# EAGLE design TSOC_RS485_EM (EAGLE 6.6.0)
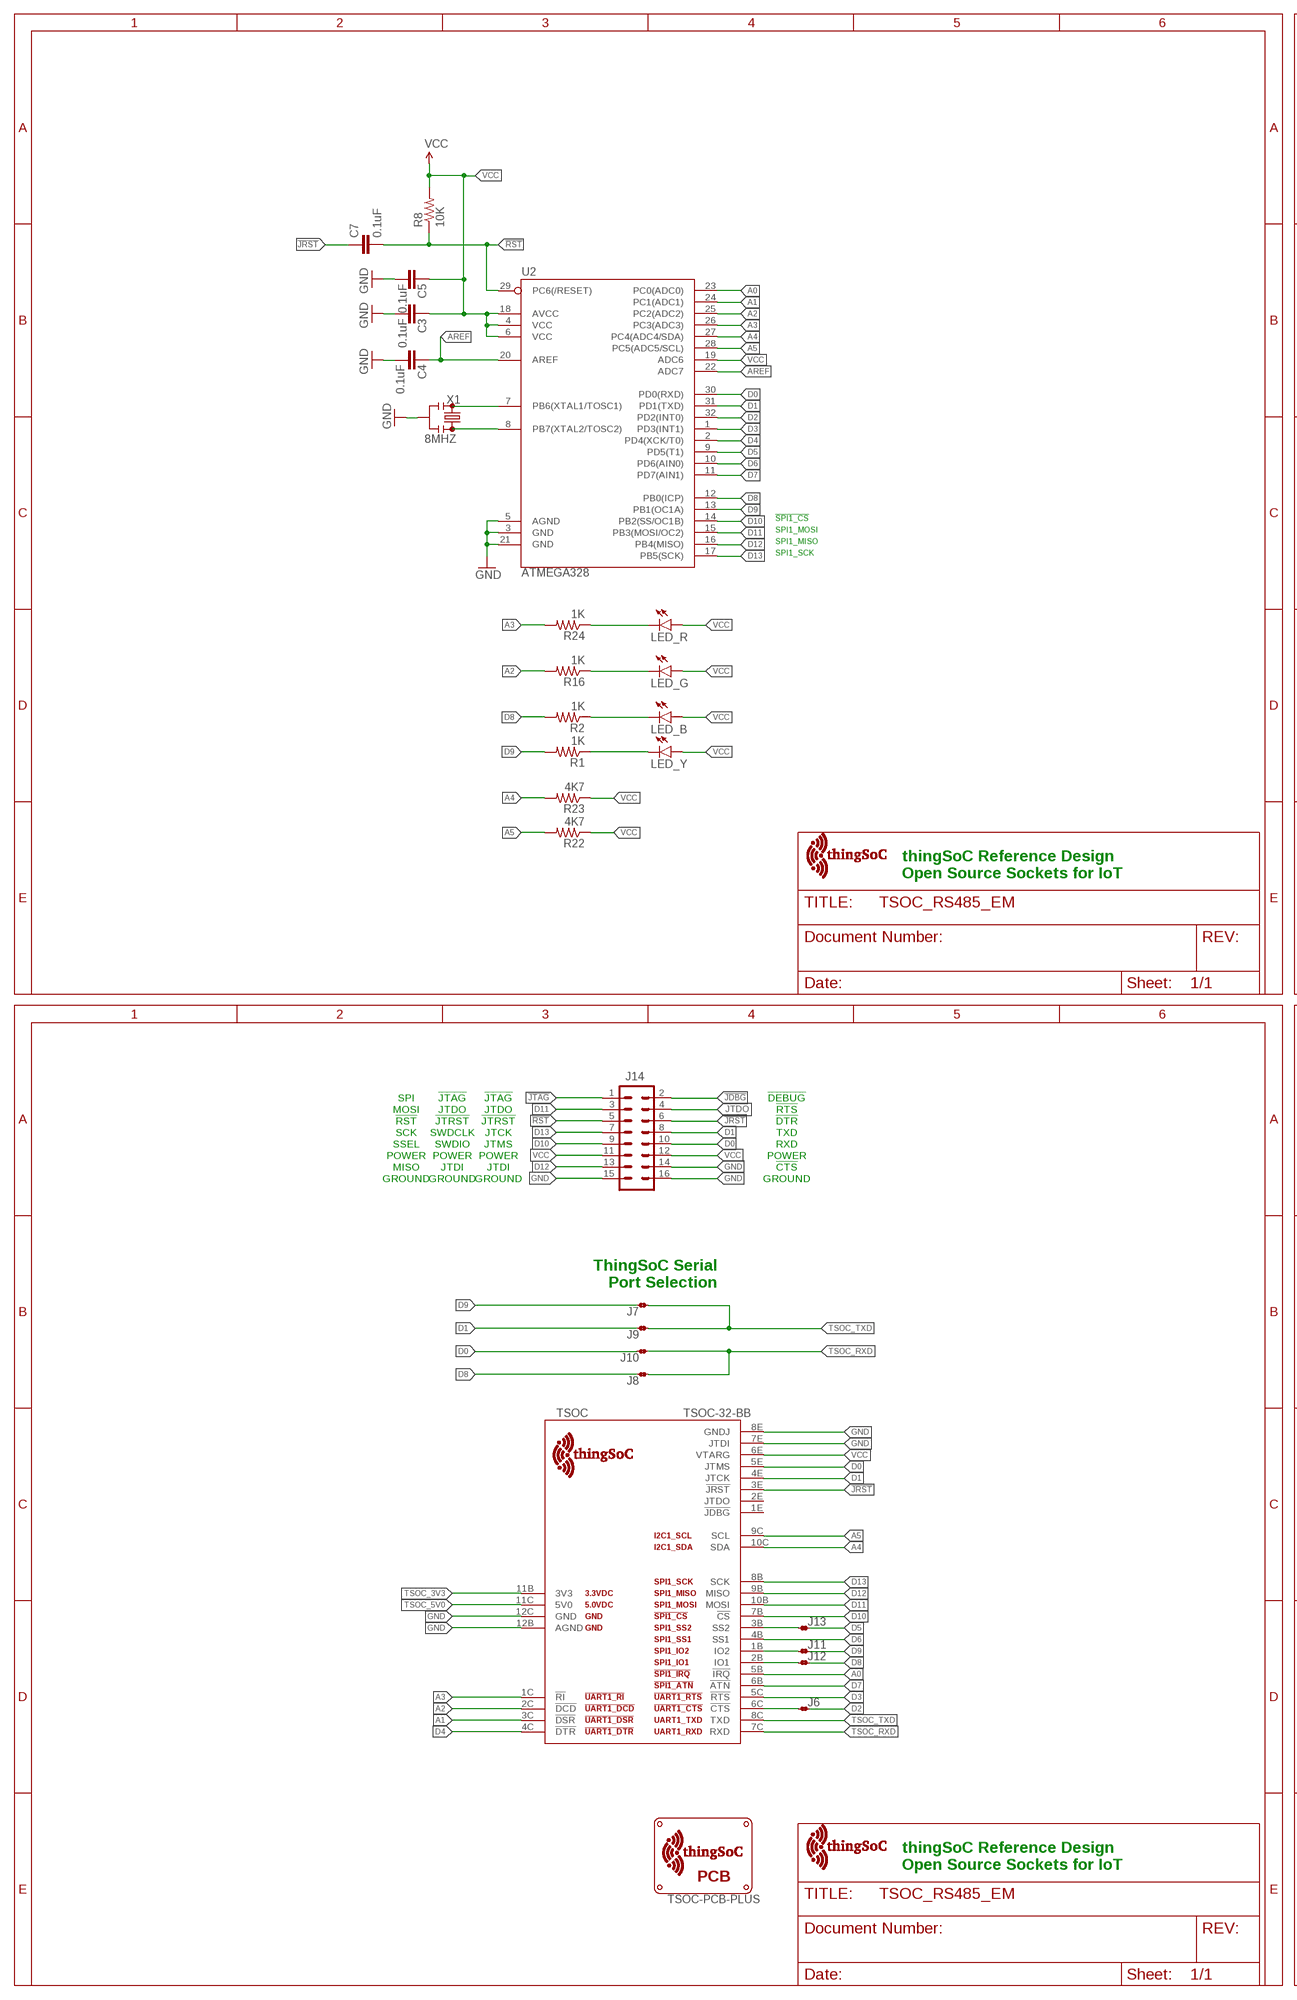
[diagram p0: schematic, sheet 1, part 1 of 2]
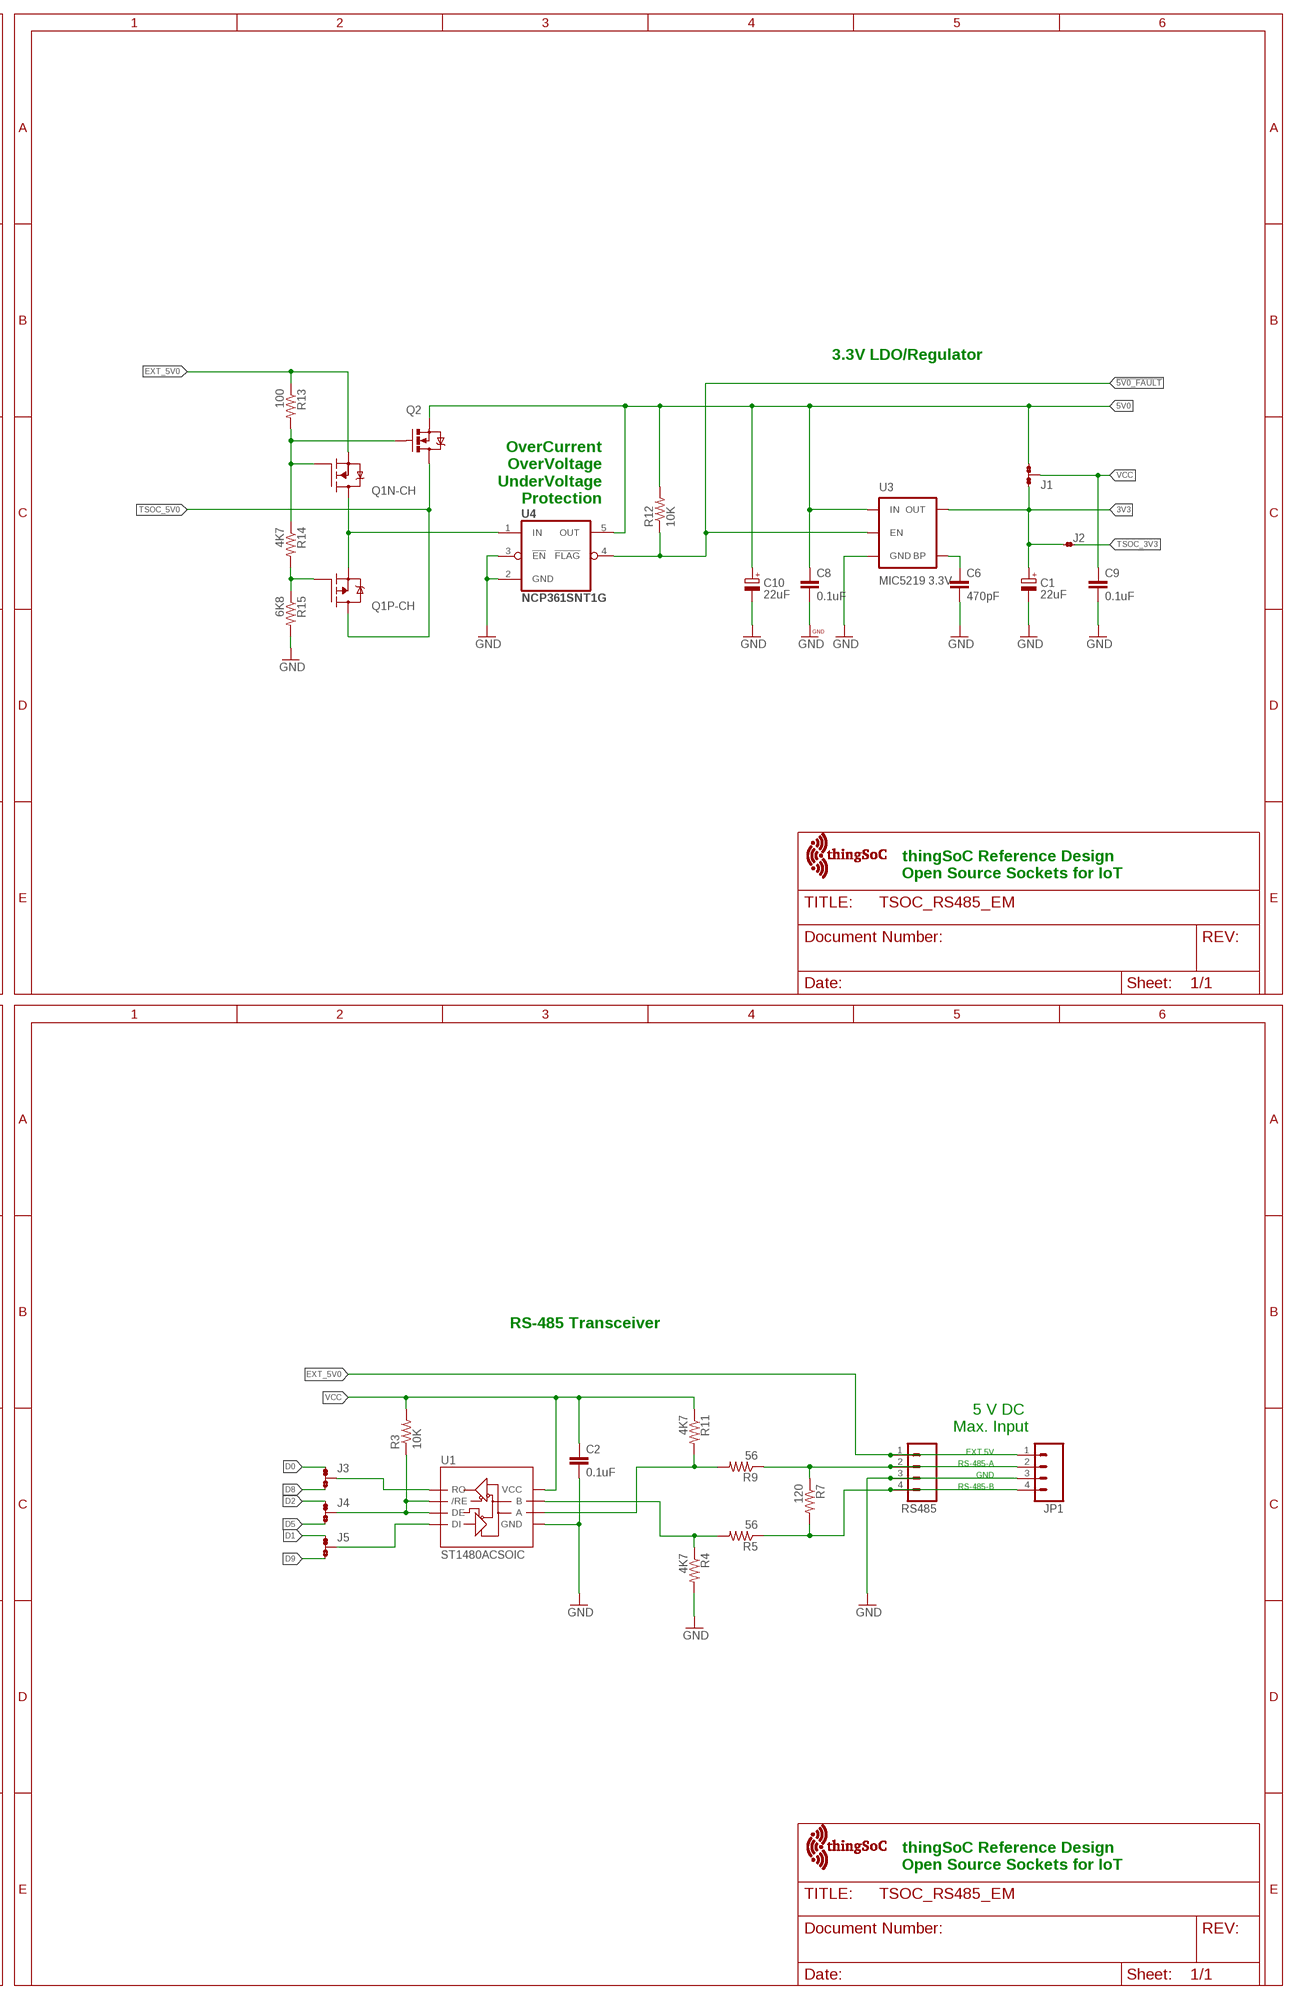
[diagram p1: schematic, sheet 1, part 2 of 2]

## Parts
C1  22uF  CPOL-EUSMCB  [SMC_B]
C2  0.1uF  CAPTYP  [EIA-0402]
C3  0.1uF  CAPTYP  [EIA-0402]
C4  0.1uF  CAPTYP  [EIA-0402]
C5  0.1uF  CAPTYP  [EIA-0402]
C6  470pF  CAPTYP  [EIA-0402]
C7  0.1uF  CAPTYP  [EIA-0402]
C8  0.1uF  CAPTYP  [EIA-0402]
C9  0.1uF  CAPTYP  [EIA-0402]
C10  22uF  CPOL-EUSMCB  [SMC_B]
J1  JMP-3-1_2  [JMP-3-1_2]
J2  JMP-2-NC  [JMP-2-NC]
J3  JMP-3-1_2  [JMP-3-1_2]
J4  JMP-3-1_2  [JMP-3-1_2]
J5  JMP-3-1_2  [JMP-3-1_2]
J6  JMP-2-NO  [JMP-2-NO]
J7  JMP-2-NO  [JMP-2-NO]
J8  JMP-2-NO  [JMP-2-NO]
J9  JMP-2-NO  [JMP-2-NO]
J10  JMP-2-NO  [JMP-2-NO]
J11  JMP-2-NC  [JMP-2-NC]
J12  JMP-2-NC  [JMP-2-NC]
J13  JMP-2-NC  [JMP-2-NC]
J14  M08X2  [2X8]
JP1  M04PTH  [1X04]
LED_B  LED0603  [LED-0603]
LED_G  LED0603  [LED-0603]
LED_R  LED0603  [LED-0603]
LED_Y  LED0603  [LED-0603]
Q1  FDC6420C  [SOT95P280X110-6N]
Q2  MOSFET-NCHANNELAO3404A  [SOT23-3]
R1  1K  RESISTOR0402-MIN  [EIA-0402-MIN]
R2  1K  RESISTOR0402-MIN  [EIA-0402-MIN]
R3  10K  RESISTOR0402-MIN  [EIA-0402-MIN]
R4  4K7  RESISTOR0402-MIN  [EIA-0402-MIN]
R5  56  RESISTOR0402-MIN  [EIA-0402-MIN]
R7  120  RESISTOR0402-MIN  [EIA-0402-MIN]
R8  10K  RESISTOR0402-MIN  [EIA-0402-MIN]
R9  56  RESISTOR0402-MIN  [EIA-0402-MIN]
R11  4K7  RESISTOR0402-MIN  [EIA-0402-MIN]
R12  10K  RESISTOR0402-MIN  [EIA-0402-MIN]
R13  100  RESISTOR0402-MIN  [EIA-0402-MIN]
R14  4K7  RESISTOR0402-MIN  [EIA-0402-MIN]
R15  6K8  RESISTOR0402-MIN  [EIA-0402-MIN]
R16  1K  RESISTOR0402-MIN  [EIA-0402-MIN]
R22  4K7  RESISTOR0402-MIN  [EIA-0402-MIN]
R23  4K7  RESISTOR0402-MIN  [EIA-0402-MIN]
R24  1K  RESISTOR0402-MIN  [EIA-0402-MIN]
RS485  M04SCREW  [SCREWTERMINAL-3.5MM-4]
TSOC  TSOC-32-BB  [TSOC-BB-S32]
U1  ST1480ACSOIC  [SO08]
U2  ATMEGA328  ATMEGA168  [TQFP32-08]
U3  MIC5219 3.3V  V_REG_MIC52193.3V  [SOT23-5]
U4  NCP361SNT1G  [SOP95P275X110-5N]
U$3  TSOC-PCB-PLUS  [TSOC-BB-BRD-PLUS]
U$5  TSOC-LOGO-SMALL  [TSOC-LOGO-SML]
U$6  TSOC-LOGO-SMALL  [TSOC-LOGO-SML]
U$7  TSOC-LOGO-SMALL  [TSOC-LOGO-SML]
U$8  TSOC-LOGO-SMALL  [TSOC-LOGO-SML]
X1  8MHZ  RESONATOR8MHZ  [RESONATOR-SMD]

## Nets
3V3: C1.+ J1.1 J2.1 U3.5(OUT)
5V0: C8.1 C10.+ J1.3 Q2.2(S) R12.2 U3.1(IN) U4.5(OUT)
!5V0_FAULT: R12.1 U3.3(EN) U4.4(!FLAG)
!JDBG: J14.2
!JRST: C7.1 J14.6 TSOC.3E(!JRST)
!JTAG: J14.1
!RST: C7.2 J14.5 R8.1 U2.29(PC6(/RESET))
A: R9.2 R11.2 U1.6(A)
A0: TSOC.5B(!IRQ) U2.23(PC0(ADC0))
A1: TSOC.3C(!DSR) U2.24(PC1(ADC1))
A2: R16.2 TSOC.2C(!DCD) U2.25(PC2(ADC2))
A3: R24.2 TSOC.1C(!RI) U2.26(PC3(ADC3))
A4: R23.2 TSOC.10C(SDA) U2.27(PC4(ADC4/SDA))
A5: R22.2 TSOC.9C(SCL) U2.28(PC5(ADC5/SCL))
AO: JP1.2 R7.1 R9.1 RS485.2
AREF: C4.2 U2.20(AREF) U2.22(ADC7)
B: R4.1 R5.2 U1.7(B)
BO: JP1.4 R5.1 R7.2 RS485.4
BYPASS1: C6.1 U3.4(BP)
D0: J3.1 J10.2 J14.10 TSOC.5E(JTMS) U2.30(PD0(RXD))
D1: J5.1 J9.2 J14.8 TSOC.4E(JTCK) U2.31(PD1(TXD))
D2: J4.1 J6.2 U2.32(PD2(INT0))
D3: TSOC.5C(!RTS) U2.1(PD3(INT1))
D4: TSOC.4C(!DTR) U2.2(PD4(XCK/T0))
D5: J4.3 J13.2 U2.9(PD5(T1))
D6: TSOC.4B(SS1) U2.10(PD6(AIN0))
D7: TSOC.6B(!ATN) U2.11(PD7(AIN1))
D8: J3.3 J8.2 J12.2 R2.2 U2.12(PB0(ICP))
D9: J5.3 J7.2 J11.2 R1.2 U2.13(PB1(OC1A))
D10: J14.9 TSOC.7B(!CS) U2.14(PB2(SS/OC1B))
D11: J14.3 TSOC.10B(MOSI) U2.15(PB3(MOSI/OC2))
D12: J14.13 TSOC.9B(MISO) U2.16(PB4(MISO))
D13: J14.7 TSOC.8B(SCK) U2.17(PB5(SCK))
DE: J4.2 R3.1 U1.2(/RE) U1.3(DE)
DI: J5.2 U1.4(DI)
EXT_5V0: JP1.1 Q1.5(N-CH:S) R13.1 RS485.1
GND: C1.- C2.2 C3.1 C4.1 C5.1 C6.2 C8.2 C9.2 C10.- J14.14 J14.15 J14.16 JP1.3 R4.2 R15.2 RS485.3 TSOC.7E(JTDI) TSOC.8E(GNDJ) TSOC.12B(AGND) TSOC.12C(GND) U1.5(GND) U2.3(GND) U2.5(AGND) U2.21(GND) U3.2(GND) U4.2(GND) U4.3(!EN) X1.2
JTDO: J14.4
LEDB: LED_B.C R2.1
LEDG: LED_G.C R16.1
LEDR: LED_R.C R24.1
LEDY: LED_Y.C R1.1
N$1: J13.1 TSOC.3B(SS2)
NGATE: Q1.1(N-CH:G) Q2.1(G) R13.2 R14.1
PGATE: Q1.3(P-CH:G) R14.2 R15.1
RXD: J3.2 U1.1(RO)
TSOC_3V3: J2.2 TSOC.11B(3V3)
TSOC_5V0: Q1.4(P-CH:D) Q2.3(D) TSOC.11C(5V0)
TSOC_CTS: J6.1 TSOC.6C(!CTS)
TSOC_D8: J12.1 TSOC.2B(IO1)
TSOC_D9: J11.1 TSOC.1B(IO2)
TSOC_RXD: J8.1 J10.1 TSOC.7C(RXD)
TSOC_TXD: J7.1 J9.1 TSOC.8C(TXD)
VCC: C2.1 C3.2 C5.2 C9.1 J1.2 J14.11 J14.12 LED_B.A LED_G.A LED_R.A LED_Y.A R3.2 R8.2 R11.1 R22.1 R23.1 TSOC.6E(VTARG) U1.8(VCC) U2.4(VCC) U2.6(VCC) U2.18(AVCC) U2.19(ADC6)
VIN: Q1.2(P-CH:S) Q1.6(N-CH:D) U4.1(IN)
XIN: U2.7(PB6(XTAL1/TOSC1)) X1.3
XOUT: U2.8(PB7(XTAL2/TOSC2)) X1.1
Unconnected: TSOC.1E(!JDBG) TSOC.2E(JTDO)

## Notes on the sheet
- 3.3V LDO/Regulator
- OverCurrent
  OverVoltage
  UnderVoltage
  Protection
- !SPI1_CS
- SPI1_MOSI
- SPI1_MISO
- SPI1_SCK
- thingSoC Reference Design
  Open Source Sockets for IoT
- thingSoC Reference Design
  Open Source Sockets for IoT
- SPI | !JTAG | !JTAG | !DEBUG
- MOSI | JTDO | JTDO | !RTS
- !RST | !JTRST | !JTRST | !DTR
- SCK | SWDCLK | JTCK | TXD
- SSEL | SWDIO | JTMS | RXD
- POWER | POWER | POWER | POWER
- MISO | JTDI | JTDI | !CTS
- GROUND | GROUND | GROUND | GROUND
- ThingSoC Serial
  Port Selection
- RS-485 Transceiver
- 5 V DC 
  Max. Input
- EXT 5V
- RS-485-A
- GND
- RS-485-B
- thingSoC Reference Design
  Open Source Sockets for IoT
- thingSoC Reference Design
  Open Source Sockets for IoT

## Library data of the parts
C1 C10 = rcl:CPOL-EU: POLARIZED CAPACITOR, European symbol
C2-C9 = PatternAgents-ProtoPads:CAP: Capacitor Standard 0603 ceramic capacitor, and 0.1" leaded capacitor.
J1 = PatternAgents-ProtoPads:JMP-3-1_2: Three Terminal Jumper - 1 & 2 Connected Positions 1and 2 are normally connected. PatternAgents ProtoPads Library Schematic and PCB layout libraries for design patterns by PatternAgents. For the CADSoft Eagle CAD program : http://www.cadsoftusa.com/download-eagle/ Source LBR : http://www.patternagents.com Github : https://github.com/PatternAgents License : http://creativecommons.org/licenses/by-sa/4.0/ (Creative Commons 4.0) THIS SOFTWARE IS PROVIDED BY THE CONTRIBUTORS "AS IS" AND WITHOUT ANY EXPRESS OR IMPLIED WARRANTIES, INCLUDING, BUT NOT LIMITED TO, THE IMPLIED WARRANTIES OF MERCHANTABILITY AND FITNESS FOR A PARTICULAR PURPOSE ARE DISCLAIMED. IN NO EVENT SHALL THE COPYRIGHT OWNER OR CONTRIBUTORS BE LIABLE FOR ANY DIRECT, INDIRECT, INCIDENTAL, SPECIAL, EXEMPLARY, OR CONSEQUENTIAL DAMAGES (INCLUDING, BUT NOT LIMITED TO, PROCUREMENT OF SUBSTITUTE GOODS OR SERVICES; LOSS OF USE, DATA, OR PROFITS; OR BUSINESS INTERRUPTION) HOWEVER CAUSED AND ON ANY THEORY OF LIABILITY, WHETHER IN CONTRACT, STRICT LIABILITY, OR TORT (INCLUDING NEGLIGENCE OR OTHERWISE) ARISING IN ANY WAY OUT OF THE USE OF THIS SOFTWARE, EVEN IF ADVISED OF THE POSSIBILITY OF SUCH DAMAGE.; BOM: EXCLUDE
J2 J11-J13 = TSOC-MODBUS-ESM:JMP-2-NC: Two Terminal Jumper - Normally Closed Positions 1 and 2 are normally connected. PatternAgents ProtoPads Library Schematic and PCB layout libraries for design patterns by PatternAgents. For the CADSoft Eagle CAD program : http://www.cadsoftusa.com/download-eagle/ Source LBR : http://www.patternagents.com Github : https://github.com/PatternAgents License : http://creativecommons.org/licenses/by-sa/4.0/ (Creative Commons 4.0) THIS SOFTWARE IS PROVIDED BY THE CONTRIBUTORS "AS IS" AND WITHOUT ANY EXPRESS OR IMPLIED WARRANTIES, INCLUDING, BUT NOT LIMITED TO, THE IMPLIED WARRANTIES OF MERCHANTABILITY AND FITNESS FOR A PARTICULAR PURPOSE ARE DISCLAIMED. IN NO EVENT SHALL THE COPYRIGHT OWNER OR CONTRIBUTORS BE LIABLE FOR ANY DIRECT, INDIRECT, INCIDENTAL, SPECIAL, EXEMPLARY, OR CONSEQUENTIAL DAMAGES (INCLUDING, BUT NOT LIMITED TO, PROCUREMENT OF SUBSTITUTE GOODS OR SERVICES; LOSS OF USE, DATA, OR PROFITS; OR BUSINESS INTERRUPTION) HOWEVER CAUSED AND ON ANY THEORY OF LIABILITY, WHETHER IN CONTRACT, STRICT LIABILITY, OR TORT (INCLUDING NEGLIGENCE OR OTHERWISE) ARISING IN ANY WAY OUT OF THE USE OF THIS SOFTWARE, EVEN IF ADVISED OF THE POSSIBILITY OF SUCH DAMAGE.; BOM: EXCLUDE
J3-J5 = TSOC_RS485_EM:JMP-3-1_2: Three Terminal Jumper - 1 & 2 Connected Positions 1and 2 are normally connected. PatternAgents ProtoPads Library Schematic and PCB layout libraries for design patterns by PatternAgents. For the CADSoft Eagle CAD program : http://www.cadsoftusa.com/download-eagle/ Source LBR : http://www.patternagents.com Github : https://github.com/PatternAgents License : http://creativecommons.org/licenses/by-sa/4.0/ (Creative Commons 4.0) THIS SOFTWARE IS PROVIDED BY THE CONTRIBUTORS "AS IS" AND WITHOUT ANY EXPRESS OR IMPLIED WARRANTIES, INCLUDING, BUT NOT LIMITED TO, THE IMPLIED WARRANTIES OF MERCHANTABILITY AND FITNESS FOR A PARTICULAR PURPOSE ARE DISCLAIMED. IN NO EVENT SHALL THE COPYRIGHT OWNER OR CONTRIBUTORS BE LIABLE FOR ANY DIRECT, INDIRECT, INCIDENTAL, SPECIAL, EXEMPLARY, OR CONSEQUENTIAL DAMAGES (INCLUDING, BUT NOT LIMITED TO, PROCUREMENT OF SUBSTITUTE GOODS OR SERVICES; LOSS OF USE, DATA, OR PROFITS; OR BUSINESS INTERRUPTION) HOWEVER CAUSED AND ON ANY THEORY OF LIABILITY, WHETHER IN CONTRACT, STRICT LIABILITY, OR TORT (INCLUDING NEGLIGENCE OR OTHERWISE) ARISING IN ANY WAY OUT OF THE USE OF THIS SOFTWARE, EVEN IF ADVISED OF THE POSSIBILITY OF SUCH DAMAGE.; BOM: EXCLUDE
J6-J10 = TSOC_RS485_EM:JMP-2-NO: Two Terminal Jumper - Normally Open Positions 1 and 2 are normally NOT connected. PatternAgents ProtoPads Library Schematic and PCB layout libraries for design patterns by PatternAgents. For the CADSoft Eagle CAD program : http://www.cadsoftusa.com/download-eagle/ Source LBR : http://www.patternagents.com Github : https://github.com/PatternAgents License : http://creativecommons.org/licenses/by-sa/4.0/ (Creative Commons 4.0) THIS SOFTWARE IS PROVIDED BY THE CONTRIBUTORS "AS IS" AND WITHOUT ANY EXPRESS OR IMPLIED WARRANTIES, INCLUDING, BUT NOT LIMITED TO, THE IMPLIED WARRANTIES OF MERCHANTABILITY AND FITNESS FOR A PARTICULAR PURPOSE ARE DISCLAIMED. IN NO EVENT SHALL THE COPYRIGHT OWNER OR CONTRIBUTORS BE LIABLE FOR ANY DIRECT, INDIRECT, INCIDENTAL, SPECIAL, EXEMPLARY, OR CONSEQUENTIAL DAMAGES (INCLUDING, BUT NOT LIMITED TO, PROCUREMENT OF SUBSTITUTE GOODS OR SERVICES; LOSS OF USE, DATA, OR PROFITS; OR BUSINESS INTERRUPTION) HOWEVER CAUSED AND ON ANY THEORY OF LIABILITY, WHETHER IN CONTRACT, STRICT LIABILITY, OR TORT (INCLUDING NEGLIGENCE OR OTHERWISE) ARISING IN ANY WAY OUT OF THE USE OF THIS SOFTWARE, EVEN IF ADVISED OF THE POSSIBILITY OF SUCH DAMAGE.; BOM: EXCLUDE
J14 = PatternAgents-ProtoPads:M08X2: .1" headers, two rows of 8 each
JP1 = TSOC_RS485_EM:M04: Header 4 Standard 4-pin 0.1" header. Use with straight break away headers (SKU : PRT-00116), right angle break away headers (PRT-00553), swiss pins (PRT-00743), machine pins (PRT-00117), and female headers (PRT-00115). Molex polarized connector foot print use with SKU : PRT-08231 with associated crimp pins and housings. 1MM SMD Version SKU: PRT-10208
LED_B LED_G LED_R LED_Y = TSOC-MODBUS-ESM:LED: LEDs Standard schematic elements and footprints for 5mm, 3mm, 1206, and 0603 sized LEDs. 5mm - Spark Fun Electronics SKU : COM-00529 (and others)
Q1 = TSOC-ESP8266-BASE:FDC6420C: N and P Channel Power Trench MOSFETs
Q2 = SparkFun-DiscreteSemi:MOSFET-NCHANNEL: Common NMOSFET Parts MFG P/N Store ID Prod ID FDD8780 TRANS-09984 SI7820DN TRANS-11055 FDS6630A IC-08089 2N7002PW TRANS-11151 FQP30N06L COM-10213 TRANS-10060 BSS123LT1G TRANS-08345 BSS138 TRANS-00830 BS170 2N7000; PROD_ID: TRAN-12988
R1-R5 R7-R9 R11-R16 R22-R24 = PatternAgents-ProtoPads:RESISTOR: Resistor Basic schematic elements and footprints for 0603, 1206, and PTH resistors.
RS485 = TSOC_RS485_EM:M04: Header 4 Standard 4-pin 0.1" header. Use with straight break away headers (SKU : PRT-00116), right angle break away headers (PRT-00553), swiss pins (PRT-00743), machine pins (PRT-00117), and female headers (PRT-00115). Molex polarized connector foot print use with SKU : PRT-08231 with associated crimp pins and housings. 1MM SMD Version SKU: PRT-10208; PROD_ID: Combine 2x8399
TSOC = thingSoC:TSOC-32: thingSoC Thirty-Two (32) Pin Socket Source LBR : http://www.thingsoc.com Github : https://github.com/thingsoc License : http://creativecommons.org/licenses/by-sa/4.0/ (Creative Commons 4.0) THIS SOFTWARE IS PROVIDED BY THE CONTRIBUTORS "AS IS" AND WITHOUT ANY EXPRESS OR IMPLIED WARRANTIES, INCLUDING, BUT NOT LIMITED TO, THE IMPLIED WARRANTIES OF MERCHANTABILITY AND FITNESS FOR A PARTICULAR PURPOSE ARE DISCLAIMED. IN NO EVENT SHALL THE COPYRIGHT OWNER OR CONTRIBUTORS BE LIABLE FOR ANY DIRECT, INDIRECT, INCIDENTAL, SPECIAL, EXEMPLARY, OR CONSEQUENTIAL DAMAGES (INCLUDING, BUT NOT LIMITED TO, PROCUREMENT OF SUBSTITUTE GOODS OR SERVICES; LOSS OF USE, DATA, OR PROFITS; OR BUSINESS INTERRUPTION) HOWEVER CAUSED AND ON ANY THEORY OF LIABILITY, WHETHER IN CONTRACT, STRICT LIABILITY, OR TORT (INCLUDING NEGLIGENCE OR OTHERWISE) ARISING IN ANY WAY OUT OF THE USE OF THIS SOFTWARE, EVEN IF ADVISED OF THE POSSIBILITY OF SUCH DAMAGE.
U1 = TSOC-MODBUS-ESM:ST1480AC: ST Microelectronics ST1480AC RS-485/RS-422 Transceiver Source : http://www.st.com/web/en/resource/technical/document/datasheet/CD00003136.pdf The ST1480Ax is ±15 kV ESD protected, 3.3 V low power transceiver for RS-485 and RS-422 communications. The device contains one driver and one receiver in half duplex configuration. The ST1480Ax transmits and receives at a guaranteed data rate of at least 12 Mbps. All transmitter outputs and receiver inputs are protected to ±15 kV using Human Body Model. Driver is short-circuit current limited and is protected against excessive power dissipation by thermal shutdown circuitry that places the driver outputs into a high-impedance state. The ST1480Ax input has a true fail-safe feature that guarantees a logic high output if both inputs are open circuit, shorted together or in the presence of a termination with no signal on the bus.
U2 = SparkFun:ATMEGA168
U3 = TSOC-ESP8266-BASE:V_REG_MIC5219: V_REG MIC5219 Standard 3.3V and 5V 500mA LDO voltage regulator in SOT-23 layout. Micrel part MIC5219. BP (by-pass) pin is used to lower output noise with 470pF cap, may be left open.; PROD_ID: VREG-09872
U4 = TSOC-ESP8266-BASE:NCP361SNT1G: USB Positive Overvoltage Protection Controller; MPN: NCP361SNT1G; OC_FARNELL: 1642242; OC_NEWARK: 01P0135; PACKAGE: TSOP-5; SUPPLIER: ON Semiconductor
U$3 = thingSoC:TSOC-PCB: thingSoC PCB Outlines Boards Outlines for Standard Sizes (in the DImension Layer) (Registration marks in the tDocu layer - make sure to turn on tDocu/bDocu) Source LBR : http://www.thingsoc.com Github : https://github.com/thingsoc License : http://creativecommons.org/licenses/by-sa/4.0/ (Creative Commons 4.0) THIS SOFTWARE IS PROVIDED BY THE CONTRIBUTORS "AS IS" AND WITHOUT ANY EXPRESS OR IMPLIED WARRANTIES, INCLUDING, BUT NOT LIMITED TO, THE IMPLIED WARRANTIES OF MERCHANTABILITY AND FITNESS FOR A PARTICULAR PURPOSE ARE DISCLAIMED. IN NO EVENT SHALL THE COPYRIGHT OWNER OR CONTRIBUTORS BE LIABLE FOR ANY DIRECT, INDIRECT, INCIDENTAL, SPECIAL, EXEMPLARY, OR CONSEQUENTIAL DAMAGES (INCLUDING, BUT NOT LIMITED TO, PROCUREMENT OF SUBSTITUTE GOODS OR SERVICES; LOSS OF USE, DATA, OR PROFITS; OR BUSINESS INTERRUPTION) HOWEVER CAUSED AND ON ANY THEORY OF LIABILITY, WHETHER IN CONTRACT, STRICT LIABILITY, OR TORT (INCLUDING NEGLIGENCE OR OTHERWISE) ARISING IN ANY WAY OUT OF THE USE OF THIS SOFTWARE, EVEN IF ADVISED OF THE POSSIBILITY OF SUCH DAMAGE.
U$5-U$8 = thingSoC:TSOC-LOGO: thingSoC Logo Source LBR : http://www.thingsoc.com Github : https://github.com/thingsoc License : http://creativecommons.org/licenses/by-sa/4.0/ (Creative Commons 4.0) THIS SOFTWARE IS PROVIDED BY THE CONTRIBUTORS "AS IS" AND WITHOUT ANY EXPRESS OR IMPLIED WARRANTIES, INCLUDING, BUT NOT LIMITED TO, THE IMPLIED WARRANTIES OF MERCHANTABILITY AND FITNESS FOR A PARTICULAR PURPOSE ARE DISCLAIMED. IN NO EVENT SHALL THE COPYRIGHT OWNER OR CONTRIBUTORS BE LIABLE FOR ANY DIRECT, INDIRECT, INCIDENTAL, SPECIAL, EXEMPLARY, OR CONSEQUENTIAL DAMAGES (INCLUDING, BUT NOT LIMITED TO, PROCUREMENT OF SUBSTITUTE GOODS OR SERVICES; LOSS OF USE, DATA, OR PROFITS; OR BUSINESS INTERRUPTION) HOWEVER CAUSED AND ON ANY THEORY OF LIABILITY, WHETHER IN CONTRACT, STRICT LIABILITY, OR TORT (INCLUDING NEGLIGENCE OR OTHERWISE) ARISING IN ANY WAY OUT OF THE USE OF THIS SOFTWARE, EVEN IF ADVISED OF THE POSSIBILITY OF SUCH DAMAGE.
X1 = TSOC_RS485_EM:RESONATOR: Resonator Small SMD resonator. Used, eg, on the Arduino Pro/ Pro Mini boards. 8MHz- XTAL-08895 16MHz- XTAL-08900; PROD_ID: XTAL-08895

## Net classes
1 vcc: width 0.254 mm

## Board
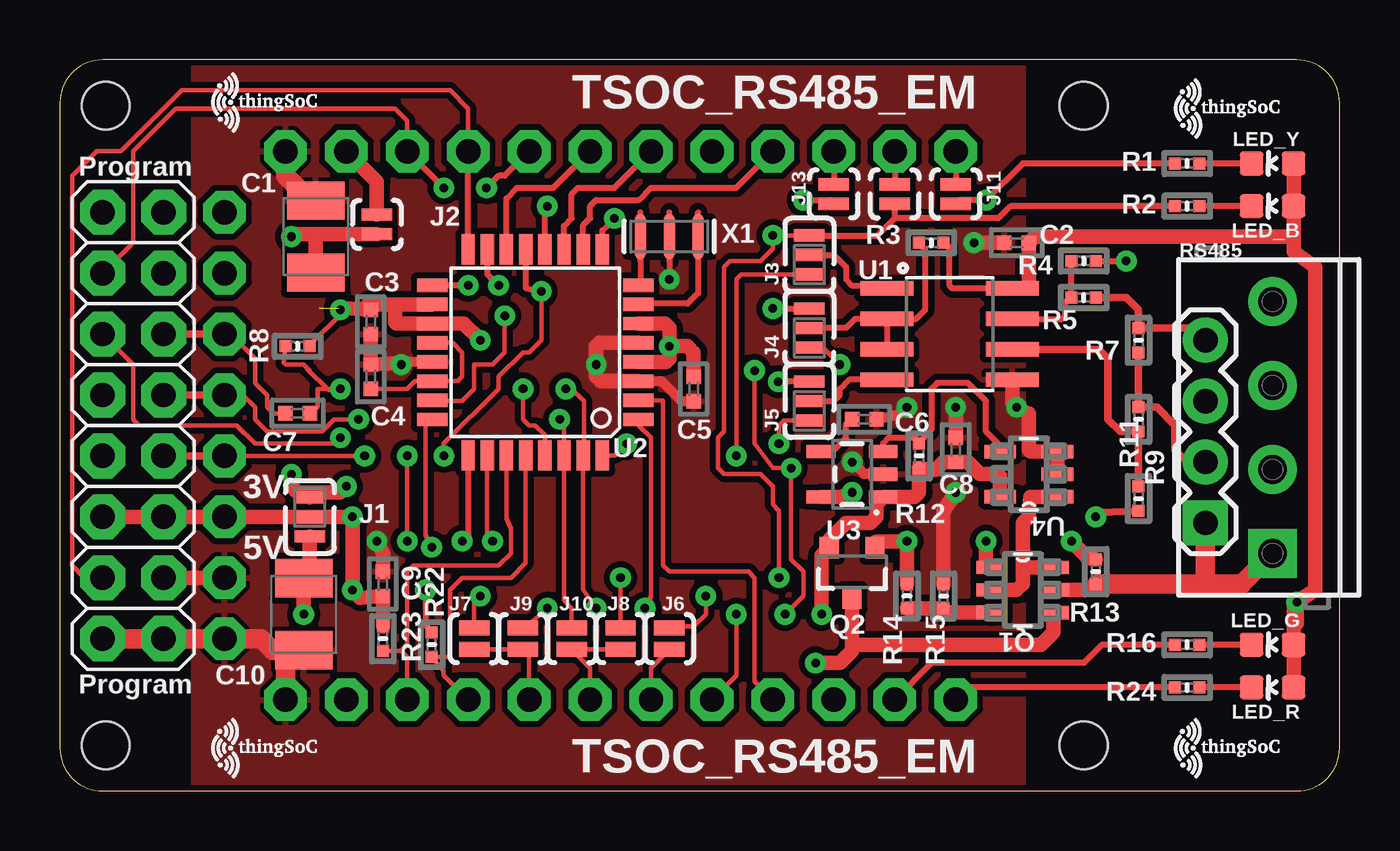
[diagram p2: board, top side]
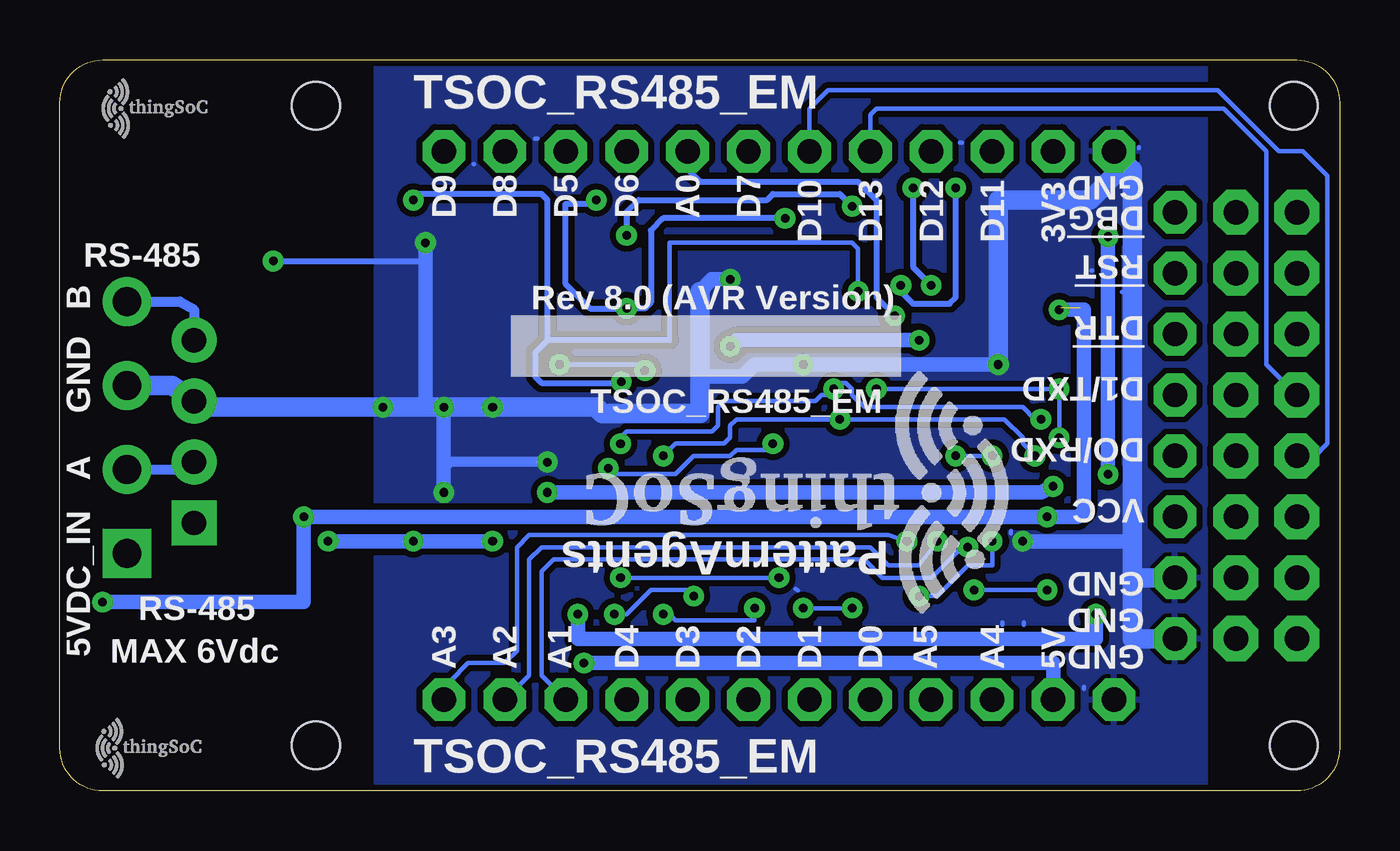
[diagram p3: board, bottom side, seen from below]

Size 53.34 x 30.48 mm. Coordinates in mm from the lower left corner, seen from the top.
Copper layers (1*16): Top 0.035mm / dielectric 1.5mm / Bottom 0.035mm
Design rules "PatternAgents_7mil": minimum track width 7mil, minimum drill 14mil, track to track 7mil, track to pad 7mil, pad to pad 7mil, via to via 7mil, smd to smd 7mil, copper to edge 7mil, drill to drill 7mil, minimum pad ring 12mil, minimum via ring 10mil, stop-mask expansion 4mil, vias tented up to drill 25mil, thermal gap 7mil

### Footprints (pad centres in the part's own frame; a part is rotated, then mirrored left to right if it is on the bottom)
SMC_B = smd 1.6 x 2.4: + -1.5,0; - 1.5,0
EIA-0402 = smd 0.6 x 0.6: 1 -0.508,0; 2 0.508,0
JMP-3-1_2 = smd 0.508 x 1.27: 1 -0.813,0; 2 0,0; 3 0.813,0
JMP-2-NC = smd 0.508 x 1.27: 1 -0.401,0; 2 0.413,0
JMP-2-NO = smd 0.635 x 1.27: 1 -0.45,0; 2 0.45,0
2X8 = drill 1.016 pad 1.88 octagon: 1 0,0; 2 0,2.54; 3 2.54,0; 4 2.54,2.54; 5 5.08,0; 6 5.08,2.54; 7 7.62,0; 8 7.62,2.54; 9 10.16,0; 10 10.16,2.54; 11 12.7,0; 12 12.7,2.54; 13 15.24,0; 14 15.24,2.54; 15 17.78,0; 16 17.78,2.54
1X04 = drill 1.016 pad 1.88 square: 1 0,0 | drill 1.016 pad 1.88: 2 2.54,0; 3 5.08,0; 4 7.62,0
LED-0603 = smd 1 x 1: A 0,-0.877; C 0,0.877
SOT95P280X110-6N = smd 1.27 x 0.559: 1 -1.295,0.94; 2 -1.295,0; 3 -1.295,-0.94; 4 1.295,-0.94; 5 1.295,0; 6 1.295,0.94
SOT23-3 = smd 0.8 x 0.9: 1 -0.95,-1; 2 0.95,-1; 3 0,1.1
EIA-0402-MIN = smd 0.5 x 0.5: 1 -0.508,0; 2 0.508,0
SCREWTERMINAL-3.5MM-4 = drill 1.2 pad 2.032 square: 1 0,0 | drill 1.2 pad 2.032: 2 3.5,0; 3 7,0; 4 10.5,0
TSOC-BB-S32 = drill 1.016 pad 1.778 octagon: 1B -11.43,-11.43; 1C -11.43,11.43; 1E 19.05,-8.89; 2B -8.89,-11.43; 2C -8.89,11.43; 2E 19.05,-6.35; 3B -6.35,-11.43; 3C -6.35,11.43; 3E 19.05,-3.81; 4B -3.81,-11.43; 4C -3.81,11.43; 4E 19.05,-1.27; 5B -1.27,-11.43; 5C -1.27,11.43; 5E 19.05,1.27; 6B 1.27,-11.43; 6C 1.27,11.43; 6E 19.05,3.81; 7B 3.81,-11.43; 7C 3.81,11.43; 7E 19.05,6.35; 8B 6.35,-11.43; 8C 6.35,11.43; 8E 19.05,8.89; 9B 8.89,-11.43; 9C 8.89,11.43; 10B 11.43,-11.43; 10C 11.43,11.43; 11B 13.97,-11.43; 11C 13.97,11.43; 12B 16.51,-11.43; 12C 16.51,11.43
SO08 = smd 0.61 x 2.21: 1 -1.905,-2.616; 2 -0.635,-2.616; 3 0.635,-2.616; 4 1.905,-2.616; 5 1.905,2.616; 6 0.635,2.616; 7 -0.635,2.616; 8 -1.905,2.616
TQFP32-08 = smd 1.27 x 0.559: 1 -4.293,2.8; 2 -4.293,2; 3 -4.293,1.2; 4 -4.293,0.4; 5 -4.293,-0.4; 6 -4.293,-1.2; 7 -4.293,-2; 8 -4.293,-2.8; 17 4.293,-2.8; 18 4.293,-2; 19 4.293,-1.2; 20 4.293,-0.4; 21 4.293,0.4; 22 4.293,1.2; 23 4.293,2; 24 4.293,2.8 | smd 0.559 x 1.27: 9 -2.8,-4.293; 10 -2,-4.293; 11 -1.2,-4.293; 12 -0.4,-4.293; 13 0.4,-4.293; 14 1.2,-4.293; 15 2,-4.293; 16 2.8,-4.293; 25 2.8,4.293; 26 2,4.293; 27 1.2,4.293; 28 0.4,4.293; 29 -0.4,4.293; 30 -1.2,4.293; 31 -2,4.293; 32 -2.8,4.293
SOT23-5 = smd 0.55 x 1.2: 1 -0.95,-1.3; 2 0,-1.3; 3 0.95,-1.3; 4 0.95,1.3; 5 -0.95,1.3
SOP95P275X110-5N = smd 1.321 x 0.559: 1 -1.194,0.94; 2 -1.194,0; 3 -1.194,-0.94; 4 1.194,-0.94; 5 1.194,0.94
TSOC-BB-BRD-PLUS = hole 2: 1.905,1.905; 28.575,1.905; 1.905,42.672; 28.575,42.672
RESONATOR-SMD = smd 0.45 x 1.905: 1 -1.2,0; 2 0,0; 3 1.2,0

### Placement (x,y rotation side)
C1  10.67,23.11 90 top
C2  39.88,22.86 180 top
C3  12.95,19.56 90 top
C4  12.95,17.27 270 top
C5  26.42,16.76 90 top
C6  33.53,15.49 0 top
C7  9.91,15.75 0 top
C8  37.34,14.22 90 top
C9  13.46,8.64 90 top
C10  10.16,7.37 270 top
J1  10.41,11.43 270 top
J2  13.21,23.62 90 top
J3  31.24,22.35 90 top
J4  31.24,19.3 90 top
J5  31.24,16.26 90 top
J6  25.4,6.35 90 top
J7  17.27,6.35 90 top
J8  23.37,6.35 90 top
J9  19.3,6.35 90 top
J10  21.34,6.35 90 top
J11  37.34,24.89 270 top
J12  34.8,24.89 270 top
J13  32.26,24.89 270 top
J14  1.78,24.13 270 top
JP1  47.75,11.18 90 top
LED_B  50.55,24.38 90 top
LED_G  50.55,6.1 90 top
LED_R  50.55,4.32 90 top
LED_Y  50.55,26.16 90 top
Q1  40.13,8.38 0 top
Q2  33.02,9.14 180 top
R1  46.99,26.16 180 top
R2  46.99,24.38 180 top
R3  36.32,22.86 0 top
R4  42.67,22.1 0 top
R5  42.67,20.57 180 top
R7  44.96,18.8 90 top
R8  9.91,18.54 0 top
R9  44.96,15.49 270 top
R11  44.96,12.19 90 top
R12  35.81,13.97 270 top
R13  43.18,9.14 90 top
R14  35.31,8.13 270 top
R15  36.83,8.13 90 top
R16  46.99,6.1 180 top
R22  15.49,6.1 270 top
R23  13.46,6.35 270 top
R24  46.99,4.32 180 top
RS485  50.55,9.91 90 top
TSOC  25.91,15.24 180 top
U1  37.08,19.05 270 top
U2  19.81,18.29 180 top
U3  33.02,13.21 90 top
U4  40.39,13.21 180 top
U$1  TSOC-LOGO-SMALL  [TSOC-LOGO-SML]  47.24,1.78 0 top
U$3  0,30.48 270 top
U$4  TSOC-LOGO-SMALL  [TSOC-LOGO-SML]  47.24,28.45 0 top
U$5  50.8,28.45 0 bottom
U$6  51.05,1.78 0 bottom
U$7  7.11,1.78 0 top
U$8  7.11,28.7 0 top
U$100  TSOC-LOGO-LRG  [TSOC-LOGO-LRG]  17.02,12.45 180 bottom
X1  25.4,23.11 0 top

### Tracks (layer width: path | path; a pad name or v marks a point on that pad's centre or on a via)
3V3  (via drill 0.36)
  Top 0.61: J2.1 10.67,23.22 | 10.67,23.22 9.76,23.22 v9.65,23.11 | U3.5 32.58,12.26 v33.02,12.45 | C1.+ 10.67,23.22 | v9.65,13.21 9.65,12.7 9.91,12.45 10.41,12.45 | 10.41,12.45 11.68,12.45 v11.94,12.7 | J1.1 10.41,12.45
  Bottom 0.61: v33.02,12.45 12.45,12.45 v11.94,12.7 | v9.65,23.11 v9.65,13.21
5V0  (via drill 0.36)
  Top 0.61: v10.16,7.37 C10.+ 10.41,9.12 J1.3 | v31.75,7.37 31.75,9.82 Q2.2 32.07,10.48 32.77,11.18 33.78,11.18 34.04,11.43 34.04,11.97 U3.1 35.63,12.26 35.81,12.45 R12.2 36.5,13.39 36.83,13.72 C8.1 37.85,13.72 38.35,13.21 39.12,13.21 39.19,13.13 U4.5
  Bottom 0.61: v31.75,7.37 31.75,6.35 10.16,6.35 v10.16,7.37
!5V0_FAULT
  Top 0.254: U4.4 39.19,14.4 38.61,14.99 38.61,16.26 37.85,17.02 36.58,17.02 36.32,16.76 36.32,15.06 R12.1 35.63,14.73 34.54,14.73 34.32,14.51 U3.3
!JRST
  Top 0.178: TSOC.3E 7.11,19.05 8.13,18.03 8.13,17.02 8.64,16.51 8.64,16 8.89,15.75 C7.1
  Top 0.305: TSOC.3E J14.6
!RST  (via drill 0.36)
  Top 0.178: R8.1 9.33,17.85 9.4,17.78 10.16,17.78 10.32,17.61 | 10.32,17.61 10.41,17.53 | v11.68,16.76 11.2,16.76 | 11.2,16.76 10.74,16.76 10.74,16 C7.2 | U2.29 20.21,14.84 19.81,15.24 19.56,15.24 19.3,15.49 v19.3,16.76 | J14.5 3.05,17.78 3.05,15.49 3.3,15.24 7.37,15.24 8.13,14.48 11.43,14.48 v11.68,14.73 | 10.32,17.61 10.31,17.6 11.2,16.71 11.2,16.76
  Bottom 0.178: v19.3,16.76 v11.68,16.76 v11.68,14.73
A
  Top 0.305: R11.2 R9.2 44.2,14.99 43.69,15.49 43.69,18.03 43.31,18.41 U1.6
A0  (via drill 0.36)
  Top 0.178: 15.55,16.26 16.76,16.26 17.27,16.76 17.27,17.78 18.03,17.78 18.54,18.29 v18.54,19.81
  Top 0.254: 15.55,16.26 U2.23
  Bottom 0.254: TSOC.5B 27.18,25.91 26.67,25.4 20.07,25.4 19.3,24.64 19.3,20.57 v18.54,19.81
A1  (via drill 0.36)
  Top 0.178: U2.24 15.24,15.46 15.24,10.67 v15.49,10.16
  Bottom 0.178: TSOC.3C 33.27,4.83 33.27,9.14 32.77,9.65 19.81,9.65 19.05,8.89 17.02,8.89 15.75,10.16 v15.49,10.16
A2  (via drill 0.36)
  Top 0.254: R16.2 43.43,6.1 42.67,5.33 36.32,5.33 TSOC.2C | U2.25 17.01,10.66 v16.76,10.41
  Bottom 0.178: v16.76,10.41 17.53,9.4 18.8,9.4 19.56,10.16 33.27,10.16 33.78,9.65 33.78,4.83 TSOC.2C
A3  (via drill 0.36)
  Top 0.178: U2.26 17.81,10.64 v18.03,10.41
  Top 0.254: R24.2 37.85,4.32 TSOC.1C
  Bottom 0.178: v18.03,10.41 18.8,10.67 33.78,10.67 34.29,10.16 34.29,5.84 34.8,5.33 36.32,5.33 37.08,4.57 37.08,4.06 TSOC.1C
A4
  Top 0.178: U2.27 18.61,11.36 18.8,10.92 18.8,9.91 18.29,9.4 14.73,9.4 14.48,9.14 14.48,6.1 14.22,5.84 | 14.22,5.84 R23.2 | TSOC.10C 14.48,5.59 14.22,5.84
A5
  Top 0.178: U2.28 19.41,9.51 18.8,8.89 16.76,8.89 16.26,8.38 16.26,5.59 R22.2 16,5.01 16,4.83 TSOC.9C
AO
  Top 0.305: R7.1 R9.1 45.72,16 46.48,15.24 46.48,14.22 46.99,13.72 JP1.2
  Bottom 0.406: RS485.2 48.32,13.41 JP1.2
AREF
  Top 0.178: U2.20 16.36,18.69 16.76,18.29 16.76,17.27 16.58,17.09 U2.22 14.8,17.09 14.48,16.76 C4.2
B
  Top 0.254: R4.1 R5.2 41.91,20.39 41.91,19.81 41.78,19.68 U1.7
BO
  Top 0.305: R5.1 44.45,20.57 44.96,20.07 R7.2 47.24,19.3 JP1.4
  Bottom 0.406: RS485.4 48.35,20.41 47.75,20.07 JP1.4
BYPASS1
  Top 0.254: U3.4 32.19,14.16 32.77,14.73 32.77,15.31 C6.1
D0  (via drill 0.36)
  Top 0.178: J3.1 28.4,21.54 28.19,21.34 v28.19,13.97 | v12.7,13.97 TSOC.5E | J10.2 21.34,7.62 21.01,7.94 U2.30 21.01,15.31 20.93,15.32 20.93,15.49 v20.83,15.49
  Top 0.305: TSOC.5E J14.10
  Bottom 0.178: v12.7,13.97 13.21,14.48 13.21,14.73 13.97,15.49 v20.83,15.49 25.15,15.49 25.4,15.24 25.4,14.73 25.65,14.48 27.69,14.48 v28.19,13.97 27.94,13.97
D1  (via drill 0.36)
  Top 0.178: J5.1 30.18,15.44 29.97,15.24 v29.97,14.48 | TSOC.4E 7.62,16.51 8.13,16 8.13,15.49 8.64,14.99 10.92,14.99 11.43,15.49 v12.45,15.49 | v21.08,16.76 21.34,16.76 21.84,16.26 21.84,14.03 U2.31 21.81,8.41 v22.35,7.62 | v20.32,7.62 20.32,7.56 J9.2
  Top 0.305: TSOC.4E J14.8
  Bottom 0.178: v12.45,15.49 12.7,15.49 13.21,16 19.81,16 20.32,16.51 20.32,16.76 20.57,17.02 20.83,17.02 v21.08,16.76 21.34,16.51 21.59,16.51 21.84,16.26 25.65,16.26 25.91,16 25.91,15.24 26.16,14.99 29.72,14.99 29.97,14.73 v29.97,14.48 | v22.35,7.62 v20.32,7.62
D2  (via drill 0.36)
  Top 0.178: J4.1 31.8,18.49 v32.51,17.78 | v28.96,17.53 28.96,14.48 29.72,13.46 v30.48,13.46 30.48,9.65 30.99,9.14 30.99,8.13 v30.23,7.37 | U2.32 23.14,13.99 v23.62,14.48 | v26.92,8.13 26.92,7.37 26.42,6.86 25.46,6.86 J6.2
  Bottom 0.178: v32.51,17.78 29.21,17.78 v28.96,17.53 | v30.23,7.37 29.72,7.37 28.7,8.38 27.18,8.38 v26.92,8.13 | v30.48,13.46 30.23,13.21 27.69,13.21 26.92,13.97 25.4,13.97 25.15,14.22 23.62,14.22 23.6,14.25 23.6,14.43 v23.62,14.48
D3  (via drill 0.36)
  Top 0.178: U2.1 24.11,15.27 24.64,14.73 24.64,8.13 v24.38,7.62 | v28.19,7.37 28.19,4.83 TSOC.5C
  Bottom 0.178: v28.19,7.37 27.94,7.37 27.69,7.11 24.38,7.11 v24.38,7.62
D4
  Top 0.178: U2.2 25.11,16.29 25.15,16.26 25.15,9.4 25.4,9.14 28.7,9.14 28.96,8.89 28.96,4.57 TSOC.4C
D5  (via drill 0.36)
  Top 0.254: v29.72,20.12 J4.3 | v30.99,24.64 32.1,24.64 J13.2 | U2.9 22.61,23.37 v23.11,23.88
  Bottom 0.254: 29.67,20.07 v29.72,20.12 | v29.72,20.12 J4.3 32.26,21.13 J13.2 31.15,24.48 v30.99,24.64 | v23.11,23.88 28.19,23.88 28.7,23.37 28.7,20.37 28.96,20.12 v29.72,20.12
D6
  Top 0.254: U2.10 21.81,23.59 22.1,23.88 22.1,24.38 22.35,24.64 24.13,24.64 24.64,25.15 28.19,25.15 TSOC.4B
D7
  Top 0.254: U2.11 21.01,23.55 21.34,23.88 21.34,24.89 21.59,25.15 23.11,25.15 TSOC.6B
D8  (via drill 0.36)
  Top 0.178: J3.3 v29.72,23.16 29.72,22.61 29.21,22.1 27.94,22.1 27.69,21.84 27.69,14.99 27.43,14.73 27.43,13.46 27.69,13.21 29.21,13.21 29.72,12.7 29.72,11.94 29.97,11.68 v29.97,8.89 | J8.2 v23.37,8.89
  Top 0.254: U2.12 20.21,24.28 v20.32,24.38 | R2.2 39.62,24.38 39.12,23.88 34.8,23.88 | 34.8,23.88 J12.2 | J3.3 34.09,23.16 34.8,23.88
  Bottom 0.178: v29.97,8.89 v23.37,8.89
  Bottom 0.254: v29.72,23.16 29.72,24.13 29.21,24.64 23.88,24.64 23.62,24.89 20.83,24.89 v20.32,24.38
D9  (via drill 0.36)
  Top 0.178: J5.3 30.73,17.07 | J7.2 17.27,7.87 v17.53,8.13 | v14.48,10.41 v14.48,13.97 | v16,13.97 16,14.48 18.29,16.76 18.29,17.27 19.3,18.29 19.56,18.29 20.07,18.8 v20.07,20.83
  Top 0.254: U2.13 19.41,20.97 v20.07,20.83 | 30.73,17.06 30.73,17.07 29.95,17.07 v29.95,17.06 29.9,17.02 | J11.2 37.5,24.64 v38.61,24.64 40.13,26.16 R1.2
  Bottom 0.178: 27.94,18.8 27.94,22.86 20.32,22.86 20.07,22.61 v20.07,20.83 | v17.53,8.13 16.76,8.13 15.49,9.4 14.48,9.4 v14.48,10.41 | v14.48,13.97 v16,13.97
  Bottom 0.254: 33.02,18.8 33.02,24.64 33.27,24.89 38.35,24.89 v38.61,24.64 | 29.9,17.02 v29.95,17.06 29.99,17.02 33.27,17.02 33.53,17.27 33.53,18.29 33.02,18.8 | 27.94,18.8 33.02,18.8
D10
  Top 0.254: U2.14 18.61,24.71 19.05,25.15 20.57,25.15 TSOC.7B
  Bottom 0.178: J14.9 1.02,13.97 0.51,14.48 0.51,25.65 1.52,26.67 2.54,26.67 5.08,29.21 21.34,29.21 22.1,28.45 TSOC.7B
D11  (via drill 0.36)
  Top 0.178: TSOC.10B 14.48,27.94 13.97,28.45 4.83,28.45 3.05,26.67 3.05,22.86 J14.3
  Top 0.254: U2.15 17.81,21.56 v18.29,21.08 | v16,25.15 TSOC.10B
  Bottom 0.254: v18.29,21.08 18.29,20.83 17.78,20.32 16.26,20.32 16,20.57 v16,25.15
D12
  Top 0.178: J14.13 1.02,8.89 0.51,9.4 0.51,25.65 1.52,26.67 2.54,26.67 5.08,29.21 16.26,29.21 17.02,28.45 TSOC.9B
  Top 0.254: U2.16 TSOC.9B
D13  (via drill 0.36)
  Top 0.254: U2.17 v17.01,21.09 v17.02,21.08 | TSOC.8B 18.54,25.65 18.29,25.65 v17.78,25.15
  Bottom 0.178: J14.7 3.05,17.78 3.05,26.67 4.83,28.45 19.3,28.45 19.56,28.19 TSOC.8B
  Bottom 0.254: v17.78,25.15 17.78,21.84 v17.02,21.08
DE
  Top 0.254: U1.2 U1.3 | U1.2 33.15,19.68 32.77,19.3 J4.2 | U1.2 35.69,19.68 36.07,20.07 36.07,22.53 R3.1
DI
  Top 0.254: J5.2 32.26,16.26 32.51,16.51 32.51,16.76 32.89,17.14 U1.4
EXT_5V0
  Top 0.61: 43.25,8.64 R13.1 43,8.38 Q1.5
  Top 0.813: 43.25,8.64 47.75,8.64 | 47.75,8.64 49.28,8.64 RS485.1 | JP1.1 47.75,8.64
GND  (via drill 0.36)
  Top 0.254: R4.2 v44.45,22.1 | 25.4,22.1 v25.4,21.34
  Top 0.406: U3.2 33.53,13.21 v33.02,13.72 | C6.2 35.05,15.75 v35.31,16 | U2.21 14.08,17.89 v14.22,17.78 | C5.1 25.91,16.26 25.08,17.09 U2.3
  Top 0.61: U1.5 39.7,16.18 v39.88,16 40.39,15.75 40.39,14.22 40.46,14.15 U4.3 U4.2 | C2.2 v38.1,22.86 | U2.5 22.5,18.69 22.35,18.54 v22.35,17.78 22.35,17.27 | R15.2 36.83,11.68 v37.34,12.45 | C8.2 v37.34,16 | 22.54,17.09 U2.3 | v14.22,17.78 14.15,17.85 C4.1 C3.1 | C9.2 13.46,9.91 v13.21,10.41 | TSOC.7E J14.14
  Top 0.813: C1.- 10.44,24.61 9.4,25.65 TSOC.12B | C10.- 9.65,5.87 | 9.65,5.87 8.87,5.87 8.38,6.35 TSOC.8E J14.16 J14.15 | TSOC.12C 9.4,5.61 9.65,5.87
  Bottom 0.178: 15.82,27.03 15.75,27.03 | 14.05,6.93 14.05,7.04 | 9.07,20.8 8.97,20.8 | 33.43,27.2 33.53,27.2 | 22.58,8.36 22.68,8.43 | 8.36,26.85 8.36,26.8 | 13.69,10.85 13.69,10.74 | 10.31,21.69 10.34,21.69 | 13.16,6.93 13.16,7.04 | 36.09,26.14 36.07,26.14 | 10.67,4.27 10.67,4.34
  Bottom 0.254: v44.45,22.1 38.1,22.1
  Bottom 0.406: v33.02,13.72 37.08,13.72 37.34,13.46
  Bottom 0.61: v38.1,22.86 38.1,22.1 38.1,16 | v25.4,21.34 26.16,21.34 26.67,20.83 | 26.67,17.27 24.89,17.27 24.38,17.78 v22.35,17.78 v14.22,17.78 | v37.34,12.45 37.34,13.46 37.34,15.75 37.59,16 | v13.21,10.41 8.64,10.41
  Bottom 0.813: RS485.3 48.66,16.91 JP1.3 47.5,16 v39.88,16 38.1,16 37.59,16 v37.34,16 v35.31,16 30.99,16 30.73,15.75 26.67,15.75 26.67,17.27 26.67,20.83 | 8.64,8.89 8.64,6.35 TSOC.8E | TSOC.7E 8.64,8.89 | 8.64,8.89 8.64,10.41 8.64,25.91 TSOC.12B 9.4,25.65 10.41,24.64 14.22,24.64 v14.22,17.78
  pour Top (isolate 0.254, hatched): 40.13,30.48 40.13,0 5.59,0 5.59,30.48
  pour Bottom (isolate 0.254, hatched): 40.13,30.48 40.13,0 5.59,0 5.59,30.48
  pour Top (isolate 0.254, hatched): 40.13,30.48 40.13,0 5.59,0 5.59,30.48
LEDB
  Top 0.254: LED_B.C R2.1
LEDG
  Top 0.254: LED_G.C R16.1
LEDR
  Top 0.254: LED_R.C R24.1
LEDY
  Top 0.254: LED_Y.C R1.1
N$1
  Top 0.254: TSOC.3B J13.1
NGATE  (via drill 0.36)
  Top 0.61: R13.2 42.85,9.72 v42.16,10.41 | v38.61,10.41 38.61,9.55 Q1.1 | Q2.1 33.97,10.35 34.04,10.41 v35.31,10.41 R14.1
  Bottom 0.61: v42.16,10.41 v38.61,10.41 v35.31,10.41
PGATE
  Top 0.61: Q1.3 36.94,7.44 R15.1 R14.2
RXD
  Top 0.254: J3.2 32.26,22.35 32.77,21.84 32.77,21.34 33.02,21.08 34.34,21.08 U1.1
TSOC_3V3
  Top 0.61: J2.2 13.21,25.4 TSOC.11B
TSOC_5V0  (via drill 0.36)
  Top 0.178: Q1.4 41.38,7.32 41.4,7.11
  Top 0.61: Q2.3 33.02,6.1 | 33.02,6.1 33.02,5.84 32.51,5.33 v31.5,5.33 | 41.4,7.11 41.4,6.6 40.89,6.1 33.02,6.1
  Bottom 0.61: TSOC.11C 11.94,5.33 v31.5,5.33
TSOC_CTS
  Top 0.178: TSOC.6C 24.64,5.14 J6.1
TSOC_D8
  Top 0.254: TSOC.2B J12.1
TSOC_D9
  Top 0.254: TSOC.1B J11.1
TSOC_RXD
  Top 0.178: J8.1 J10.1 22.1,5.14 TSOC.7C
TSOC_TXD
  Top 0.178: TSOC.8C 19.56,5.65 J9.1 J7.1
VCC  (via drill 0.36)  (1 unrouted)
  Top 0.178: R8.2 10.49,18.67 11.73,19.91 v11.68,20.07
  Top 0.254: U1.8 37.21,20.95 37.08,21.08 37.08,22.68 R3.2 | v15.24,8.38 15.24,6.93 R22.1
  Top 0.305: R11.1 43.36,11.61 v43.18,11.43
  Top 0.406: 25.58,18.36 v25.4,18.54
  Top 0.61: LED_R.A LED_G.A 51.42,6.86 | 51.42,6.86 51.42,7.74 v51.56,7.87 | v51.56,7.87 52.32,8.38 52.32,21.84 51.42,22.49 51.42,23.11 | LED_Y.A LED_B.A 51.42,23.11 | 51.42,23.11 40.64,23.11 C2.1 40.39,21.08 40.26,20.95 U1.8 | v51.56,7.87 51.56,7 51.42,6.86 | v17.53,18.8 16.83,19.49 U2.19 14.04,19.49 13.97,19.56 13.97,20.29 | U2.4 25.25,17.89 25.4,18.03 v25.4,18.54 | U2.6 25.22,19.49 25.4,19.3 v25.4,18.54 | R23.1 C9.1 12.52,8.06 v12.19,8.38 v12.19,11.43 J1.2 TSOC.6E J14.12 J14.11 | U2.18 13.97,20.29 | 13.97,20.29 12.85,20.29 C3.2 11.76,20.14 v11.68,20.07 11.61,20.14 | C5.2 26.42,18.29 26.16,18.54 v25.4,18.54
  Bottom 0.178: v15.24,8.38 v12.19,8.38
  Bottom 0.61: v51.56,7.87 43.18,7.87 v43.18,11.43 v12.19,11.43 10.92,11.43 10.67,11.68 10.67,20.07 v11.68,20.07 | v17.53,18.8 25.15,18.8 v25.4,18.54
VIN
  Top 0.61: Q1.2 39.88,8.38 40.13,8.64 40.13,9.4 | 40.13,9.4 40.13,11.18 40.39,11.43 40.39,11.68 40.46,12.27 U4.1 | Q1.6 40.21,9.32 40.13,9.4
XIN
  Top 0.254: 26.6,22.1 26.6,20.76 26.16,20.32 24.14,20.32 U2.7
XOUT
  Top 0.178: 24.2,22.25 24.13,22.25 X1.1
  Top 0.254: 24.2,23.37 X1.1 24.2,22.25 24.2,21.18 U2.8

### Text on the board
tPlace: TSOC_RS485_EM | Program | 3V | 5V | Program | TSOC_RS485_EM
bPlace: TSOC_RS485_EM | GND | !DBG | D7 | A0 | D6 | D5 | D8 | D9 | 3V3 | D11 | D12 | D13 | D10 | RS-485 | !RST | Rev 8.0 (AVR Version) | !DTR | B | D1/TXD | TSOC_RS485_EM | GND | DO/RXD | A | VCC | PatternAgents | GND | GND | RS-485 | GND | MAX 6Vdc | 5VDC_IN | 5V | A4 | A5 | D0 | D1 | D2 | D3 | D4 | A1 | A2 | A3 | TSOC_RS485_EM